# Altium project 3763.PrjPCB
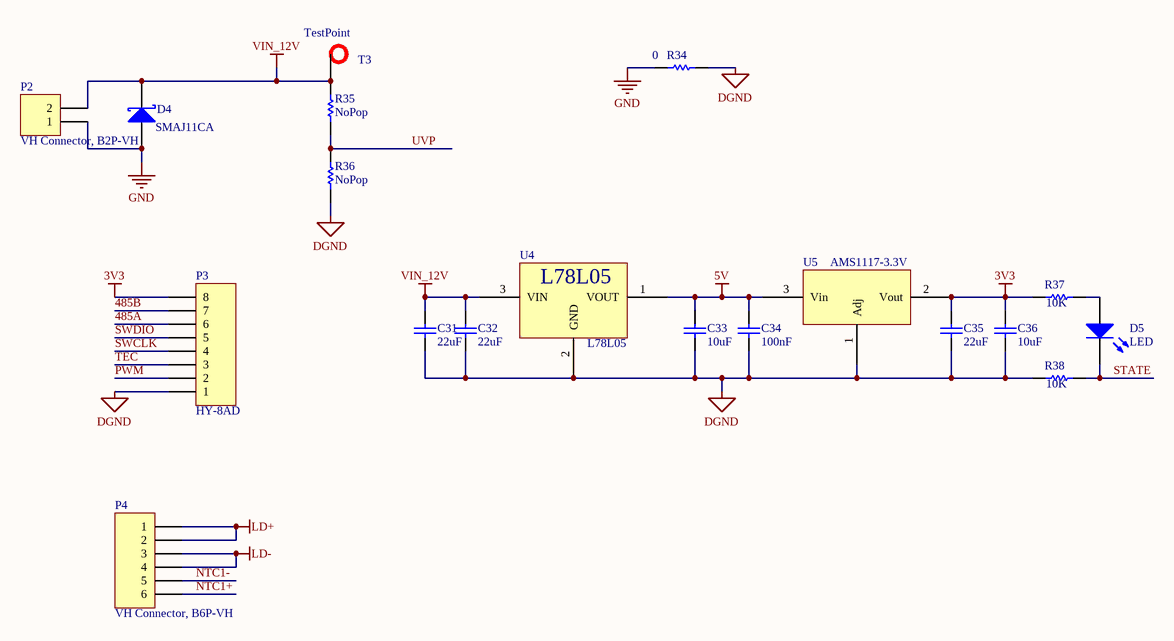
[diagram p0: PWR.SchDoc]
3 sheets, 66 parts. Net scope: global (net labels, ports and power ports of the same name join across sheets).
Board file: Green.PcbDoc
Sheets:
  PWR.SchDoc
  MCU.SchDoc
  3763.SchDoc

## Sheet PWR.SchDoc
size A4

### Parts
C31  22uF  [1608[0603]]
C32  22uF  [1608[0603]]
C33  10uF  [1608[0603]]
C34  100nF  [1608[0603]]
C35  22uF  [1608[0603]]
C36  10uF  [1608[0603]]
D4  SMAJ11CA  [SMA_DIOM5226X26N]
D5  LED  [2012[0805] - LED]
P2  VH Connector, B2P-VH  [2PIN-B2P_VH]
P3  HY-8AD  [8P -HY-8AD]
P4  VH Connector, B6P-VH  [6PIN-B6P_VH]
R34  0  [2012[0805]]
R35  NoPop  [1608[0603]]
R36  NoPop  [1608[0603]]
R37  10K  [1608[0603]]
R38  10K  [1608[0603]]
T3  Test Point  [TestPoint]  (value not drawn)
U4  L78L05  [SOT89-150P410X160-3N]
U5  AMS1117-3.3V  [SOT89-150P410X160-3N]

### Nets
3V3: C35.2 C36.2 P3.8 R37.2 U5.2(Vout)
5V: C33.2 C34.2 U4.1(VOUT) U5.3(Vin)
DGND: C31.1 C32.1 C33.1 C34.1 C35.1 C36.1 P3.1 P4.5 R34.1 R36.1 R38.2 U4.2(GND) U5.1(Adj)  [also labelled NTC1-]  [project net LP-]
GND: D4.1(A) P2.1 R34.2
LD+: P4.1 P4.2  [project net SENSE_N]
LD-: P4.3 P4.4
VIN_12V: C31.2 C32.2 D4.2(K) P2.2 R35.2 T3.1(TP) U4.3(VIN)  [project net IN_N]
485A: P3.6
485B: P3.7
NTC1+: P4.6
PWM: P3.2
STATE: D5.2(K) R38.1
SWCLK: P3.4
SWDIO: P3.5
TEC: P3.3
UVP: R35.1 R36.2
NetD5_1: D5.1(A) R37.1

### Notes on the sheet
- (in symbol TP) TestPoint

### Library data of the parts
C31-C36 = Cap: Capacitor; Published: 8-Jun-2000; LatestRevisionDate: 17-Jul-2002; LatestRevisionNote: Re-released for DXP Platform.; PackageReference: RAD-0.3; Publisher: Altium Limited; PackageDescription: Radial Cap, Thru-Hole; 2 Leads; 0.3 in Pin Spacing
  C31 C32 C35: Value: 22uF
  C33 C36: Value: 10uF
  C34: Value: 100nF
D4 = D Schottky: Schottky Diode; Published: 8-Jun-2000; LatestRevisionDate: 17-Jul-2002; LatestRevisionNote: Re-released for DXP Platform.; PackageReference: SMB; Publisher: Altium Limited; PackageDescription: DO-214-AA/SMB; 2 C-Bend Leads; Body 5.3 x 3.6 mm, inc. leads (LxW); Code_JEDEC: DO-214-AA
D5 = LED0: Typical INFRARED GaAs LED; Published: 8-Jun-2000; LatestRevisionDate: 08-Jul-2005; LatestRevisionNote: Mech Layer 1 removed.; PackageReference: LED-0; Publisher: Altium Limited; PackageDescription: LED; 2 Leads
P2 = Header 2: Header, 2-Pin; LatestRevisionDate: 17-Jul-2002; LatestRevisionNote: Re-released for DXP Platform.; Publisher: Altium Limited
P3 = Header 8: Header, 8-Pin; LatestRevisionDate: 17-Jul-2002; LatestRevisionNote: Re-released for DXP Platform.; Publisher: Altium Limited
P4 = Header 6: Header, 6-Pin; LatestRevisionDate: 17-Jul-2002; LatestRevisionNote: Re-released for DXP Platform.; Publisher: Altium Limited
R34 R37 R38 = Res1: Resistor; Published: 8-Jun-2000; LatestRevisionDate: 17-Jul-2002; LatestRevisionNote: Re-released for DXP Platform.; PackageReference: AXIAL-0.3; Publisher: Altium Limited; PackageDescription: Axial Device, Thru-Hole; 2 Leads; 0.3 in Pin Spacing
  R34: Value: 0
  R37 R38: Value: 10K
R35 = Res1: Resistor; Value: 20k; Published: 8-Jun-2000; LatestRevisionDate: 17-Jul-2002; LatestRevisionNote: Re-released for DXP Platform.; PackageReference: AXIAL-0.3; Publisher: Altium Limited; PackageDescription: Axial Device, Thru-Hole; 2 Leads; 0.3 in Pin Spacing
R36 = Res1: Resistor; Value: 2k; Published: 8-Jun-2000; LatestRevisionDate: 17-Jul-2002; LatestRevisionNote: Re-released for DXP Platform.; PackageReference: AXIAL-0.3; Publisher: Altium Limited; PackageDescription: Axial Device, Thru-Hole; 2 Leads; 0.3 in Pin Spacing
T3 = TP
U4 = PWR_L78L05: POSITIVE VOLTAGE REGULATORS
U5 = PWR_LM1XXX: 5V转3V3 10mA  DC/DC

## Sheet MCU.SchDoc
size A4
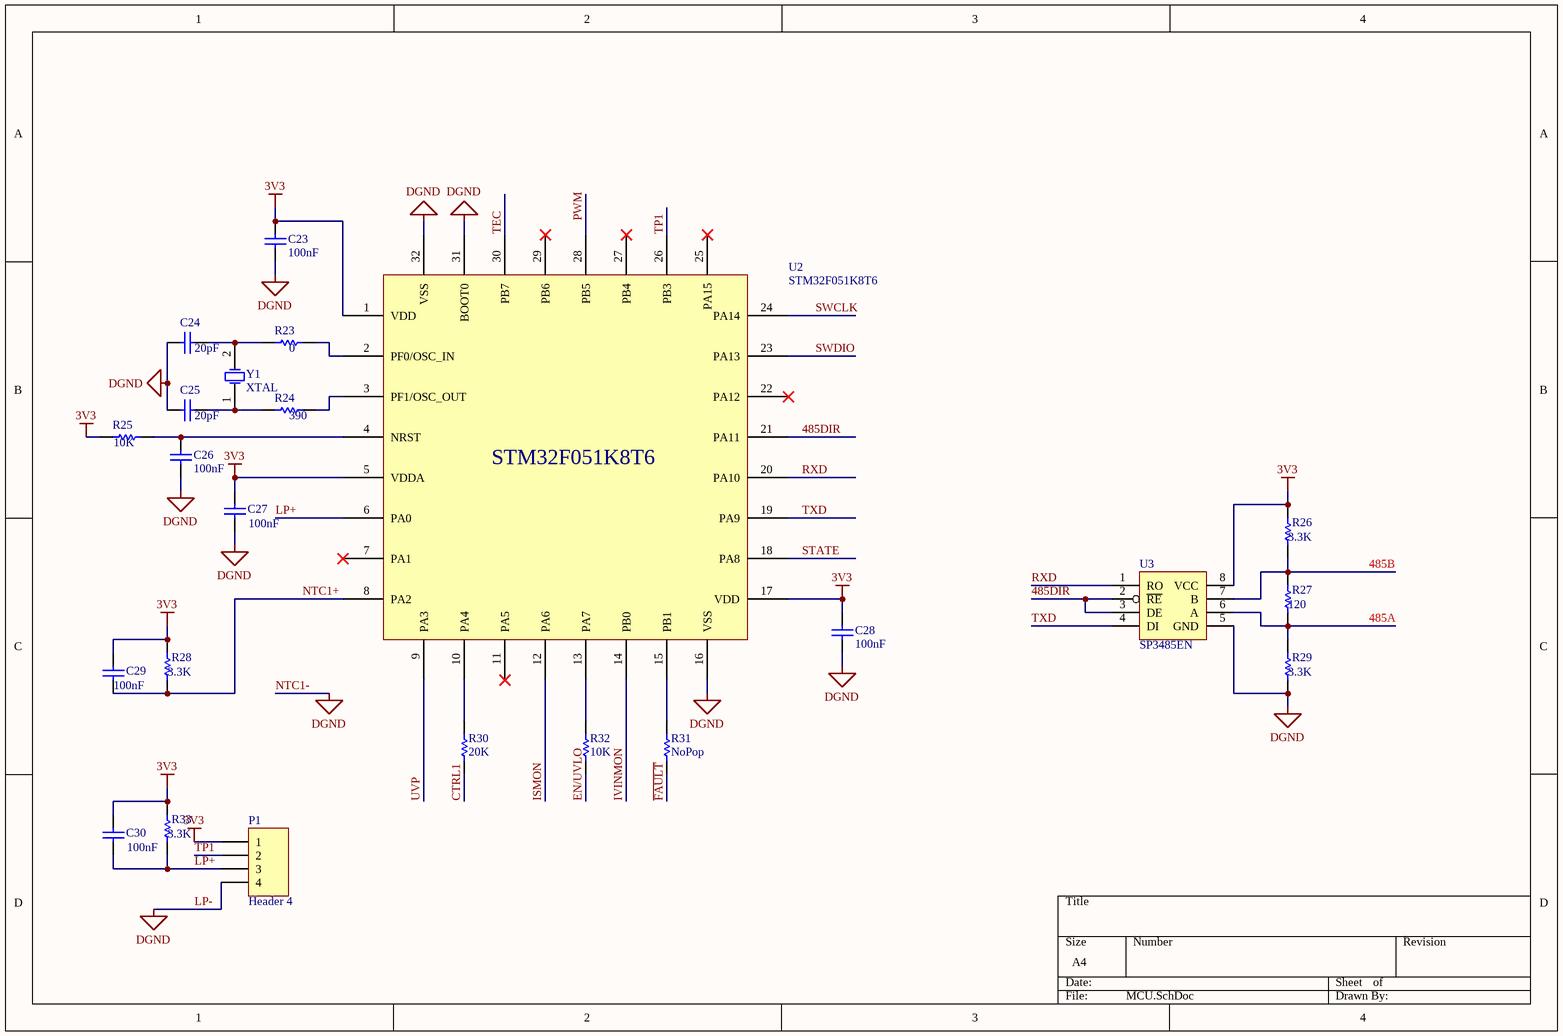
[diagram p1: MCU.SchDoc]

### Parts
C23  100nF  [1608[0603]]
C24  20pF  [1608[0603]]
C25  20pF  [1608[0603]]
C26  100nF  [1608[0603]]
C27  100nF  [1608[0603]]
C28  100nF  [1608[0603]]
C29  100nF  [1608[0603]]
C30  100nF  [1608[0603]]
P1  Header 4  [HDR1X4]
R23  0  [1608[0603]]
R24  390  [1608[0603]]
R25  10K  [1608[0603]]
R26  3.3K  [1608[0603]]
R27  120  [1608[0603]]
R28  3.3K  [1608[0603]]
R29  3.3K  [1608[0603]]
R30  20K  [1608[0603]]
R31  NoPop  [1608[0603]]
R32  10K  [1608[0603]]
R33  3.3K  [1608[0603]]
U2  STM32F051K8T6  [TQFP80P900X900X160-32N]
U3  SP3485EN  [SOIC127P600-8N]
Y1  XTAL  [XTAL_SMT]

### Nets
3V3: C23.2 C27.1 C28.2 C29.1 C30.1 P1.1 R25.2 R26.2 R28.1 R33.1 U2.1(VDD) U2.5(VDDA) U2.17(VDD) U3.8(VCC)
LP-: C23.1 C24.2 C25.2 C26.1 C27.2 C28.1 P1.4 R29.1 U2.16(VSS) U2.31(BOOT0) U2.32(VSS) U3.5(GND)  [also labelled DGND, NTC1-]
485A: R27.1 R29.2 U3.6(A)
485B: R26.1 R27.2 U3.7(B)
485DIR: U2.21(PA11) U3.2(~{RE}) U3.3(DE)
CTRL1: R30.1
EN/UVLO: R32.1
~{FAULT}: R31.1
ISMON: U2.12(PA6)
IVINMON: U2.14(PB0)
LP+: C30.2 P1.3 R33.2 U2.6(PA0)
NTC1+: C29.2 R28.2 U2.8(PA2)
PWM: U2.28(PB5)
RXD: U2.20(PA10) U3.1(RO)
STATE: U2.18(PA8)
SWCLK: U2.24(PA14)
SWDIO: U2.23(PA13)
TEC: U2.30(PB7)
TP1: P1.2 U2.26(PB3)
TXD: U2.19(PA9) U3.4(DI)
UVP: U2.9(PA3)
NetC24_1: C24.1 R23.1 Y1.2(OSC2)
NetC25_1: C25.1 R24.1 Y1.1(OSC1)
NetC26_2: C26.2 R25.1 U2.4(NRST)
NetR23_2: R23.2 U2.2(PF0/OSC_IN)
NetR24_2: R24.2 U2.3(PF1/OSC_OUT)
NetR30_2: R30.2 U2.10(PA4)
NetR31_2: R31.2 U2.15(PB1)
NetR32_2: R32.2 U2.13(PA7)

Not connected (* = marked no-connect by the designer): U2 7(PA1)* 11(PA5)* 22(PA12)* 25(PA15)* 27(PB4)* 29(PB6)*

### Library data of the parts
C23-C30 = Cap: Capacitor; Published: 8-Jun-2000; LatestRevisionDate: 17-Jul-2002; LatestRevisionNote: Re-released for DXP Platform.; PackageReference: RAD-0.3; Publisher: Altium Limited; PackageDescription: Radial Cap, Thru-Hole; 2 Leads; 0.3 in Pin Spacing
  C23 C26-C30: Value: 100nF
  C24 C25: Value: 20pF
P1 = Header 4: Header, 4-Pin; LatestRevisionDate: 17-Jul-2002; LatestRevisionNote: Re-released for DXP Platform.; Publisher: Altium Limited
R23-R30 R32 R33 = Res1: Resistor; Published: 8-Jun-2000; LatestRevisionDate: 17-Jul-2002; LatestRevisionNote: Re-released for DXP Platform.; PackageReference: AXIAL-0.3; Publisher: Altium Limited; PackageDescription: Axial Device, Thru-Hole; 2 Leads; 0.3 in Pin Spacing
  R23: Value: 0
  R24: Value: 390
  R25 R32: Value: 10K
  R26 R28 R29 R33: Value: 3.3K
  R27: Value: 120
  R30: Value: 20k
R31 = Res1: Resistor; Value: 0; Published: 8-Jun-2000; LatestRevisionDate: 17-Jul-2002; LatestRevisionNote: Re-released for DXP Platform.; PackageReference: AXIAL-0.3; Publisher: Altium Limited; PackageDescription: Axial Device, Thru-Hole; 2 Leads; 0.3 in Pin Spacing
U2 = MCU_STM32F051K8T6: Low- and medium-density advanced ARM?-based 32-bit MCU with  16 to 64 Kbytes Flash, timers, ADC, DAC and comm. interfaces
U3 = LGC_RS485: Low-Power, Slew-Rate-Limited  RS-485/RS-422 Transceivers
Y1 = XTAL: Crystal Oscillator; Published: 8-Jun-2000; LatestRevisionDate: 17-Jul-2002; LatestRevisionNote: Re-released for DXP Platform.; PackageReference: R38; Publisher: Altium Limited; PackageDescription: Crystal, Thru-Hole; 2 Leads; Body 3.1 x 8.2 mm (Dia.xH)

## Sheet 3763.SchDoc
size A4
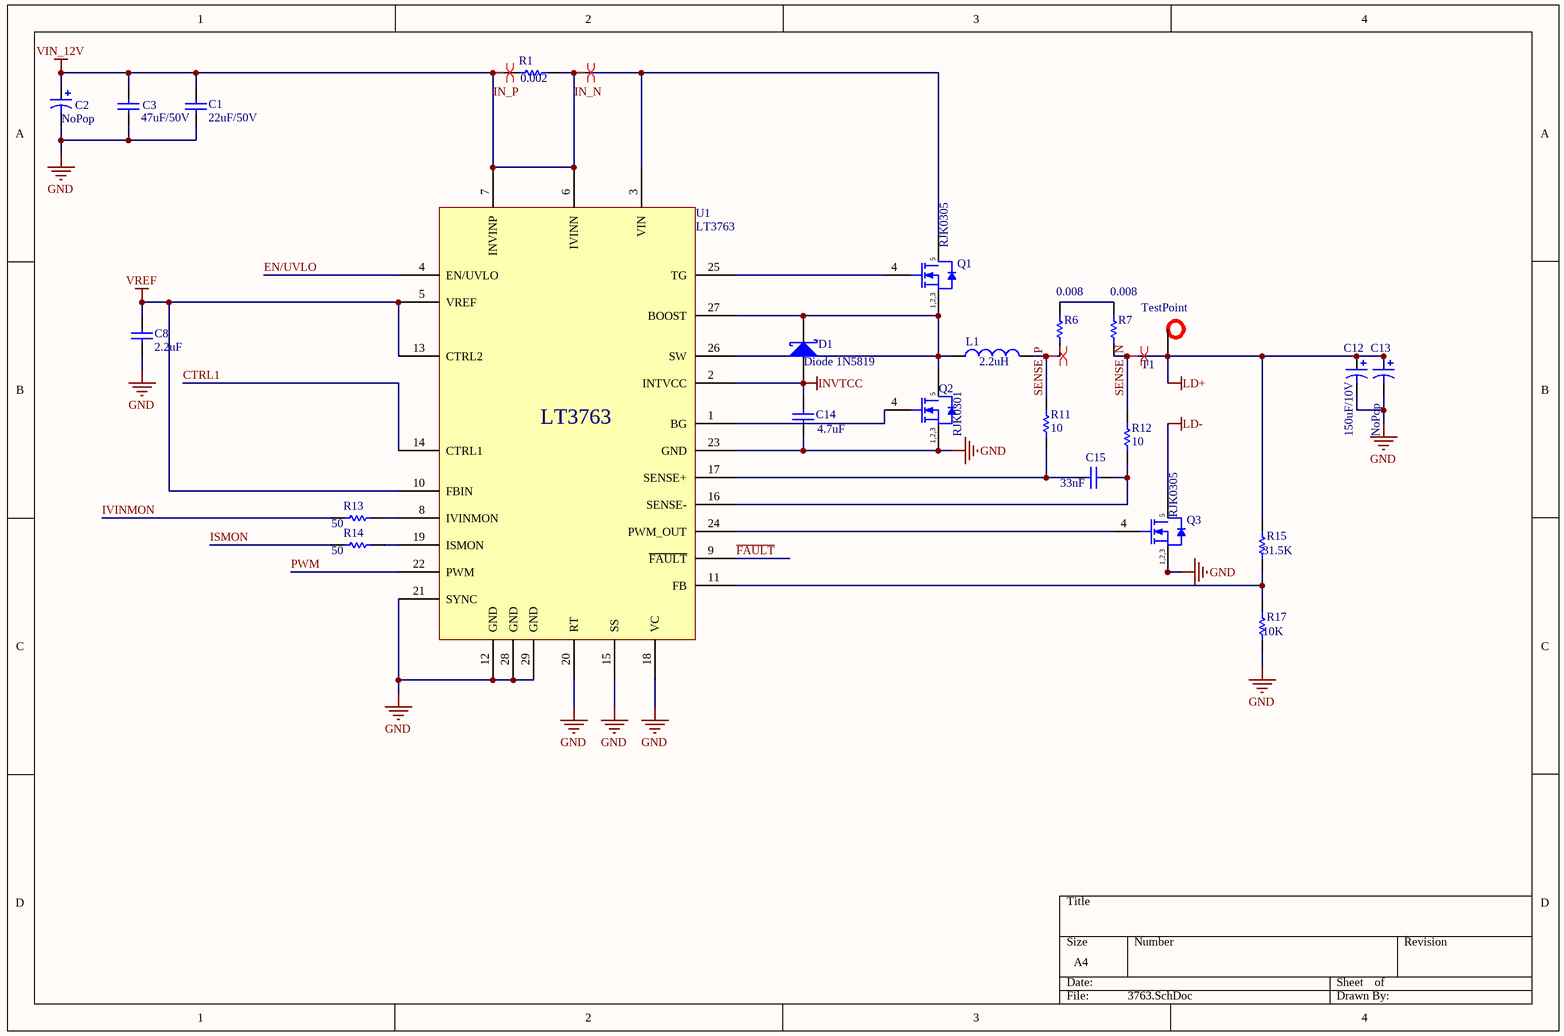
[diagram p2: 3763.SchDoc]

### Parts
C1  22uF/50V  [1206[3216] - NP]
C2  NoPop  [SMC_Altium Capacity 8*10]
C3  47uF/50V  [1206[3216] - NP]
C8  2.2uF  [1608[0603]]
C12  150uF/10V  [7343]
C13  NoPop  [SMC_Altium Capacity 8*10]
C14  4.7uF  [1608[0603]]
C15  33nF  [1608[0603]]
D1  Diode 1N5819  [SMA]
L1  value 2.2uH  [IHLP4040]  (hidden comment: Inductor,2.2uH)
Q1  RJK0305  [LFPAK]
Q2  RJK0301  [LFPAK]
Q3  RJK0305  [LFPAK]
R1  0.002  [2512[6432]]
R6  0.008  [2512[6432]]
R7  0.008  [2512[6432]]
R11  10  [1608[0603]]
R12  10  [1608[0603]]
R13  50  [1608[0603]]
R14  50  [1608[0603]]
R15  31.5K  [1608[0603]]
R17  10K  [1608[0603]]
T1  Test Point  [TestPoint]  (value not drawn)
U1  LT3763  [TSOP65P640X120_HS-29N]

### Nets
GND: C1.1 C2.2 C3.1 C8.1 C12.2 C13.2 C14.1 Q2.1(SOURCE) Q2.2(SOURCE) Q2.3(SOURCE) Q3.1(SOURCE) Q3.2(SOURCE) Q3.3(SOURCE) R17.2 U1.12(GND) U1.15(SS) U1.18(VC) U1.20(RT) U1.21(SYNC) U1.23(GND) U1.28(GND) U1.29(GND)
IN_N: C1.2 C2.1 C3.2 Q1.5(DRAIN) R1.1 R1.2 U1.3(VIN) U1.6(IVINN) U1.7(INVINP)  [also labelled IN_P, VIN_12V]
INVTCC: C14.2 D1.1(A) U1.2(INTVCC)
LD-: Q3.5(DRAIN)
SENSE_N: C12.1 C13.1 R7.1 R12.2 R15.1 T1.1(TP)  [also labelled LD+]
VREF: C8.2 U1.5(VREF) U1.10(FBIN) U1.13(CTRL2)
CTRL1: U1.14(CTRL1)
EN/UVLO: U1.4(EN/UVLO)
~{FAULT}: U1.9(~{FAULT})
ISMON: R14.2
IVINMON: R13.2
PWM: U1.22(PWM)
SENSE_P: L1.2 R6.1 R11.2
NetC15_1: C15.1 R11.1 U1.17(SENSE+)
NetC15_2: C15.2 R12.1 U1.16(SENSE-)
NetD1_2: D1.2(K) L1.1 Q1.1(SOURCE) Q1.2(SOURCE) Q1.3(SOURCE) Q2.5(DRAIN) U1.26(SW) U1.27(BOOST)
NetQ1_4: Q1.4(GATE) U1.25(TG)
NetQ2_4: Q2.4(GATE) U1.1(BG)
NetQ3_4: Q3.4(GATE) U1.24(PWM_OUT)
NetR6_2: R6.2 R7.2
NetR13_1: R13.1 U1.8(IVINMON)
NetR14_1: R14.1 U1.19(ISMON)
NetR15_2: R15.2 R17.1 U1.11(FB)

### Layout directives
differential pair: IN_N, SENSE_N, SENSE_P

### Notes on the sheet
- (in symbol PWR_RJK030) 1,2,3
- (in symbol TP) TestPoint

### Library data of the parts
C1 = Cap: Capacitor; Value: 22uF; Published: 8-Jun-2000; LatestRevisionDate: 17-Jul-2002; LatestRevisionNote: Re-released for DXP Platform.; PackageReference: RAD-0.3; Publisher: Altium Limited; PackageDescription: Radial Cap, Thru-Hole; 2 Leads; 0.3 in Pin Spacing
C2 C13 = Cap Pol1: Altium Electrolytic Cap; Value: 100uF/50V; Published: 8-Jun-2000; LatestRevisionDate: 17-Jul-2002; LatestRevisionNote: Re-released for DXP Platform.; PackageReference: RB7.6-15; Publisher: Altium Limited; PackageDescription: Polarized Capacitor (Radial); 2 Leads
C3 = Cap: Capacitor; Value: 47uF; Published: 8-Jun-2000; LatestRevisionDate: 17-Jul-2002; LatestRevisionNote: Re-released for DXP Platform.; PackageReference: RAD-0.3; Publisher: Altium Limited; PackageDescription: Radial Cap, Thru-Hole; 2 Leads; 0.3 in Pin Spacing
C8 C14 C15 = Cap: Capacitor; Published: 8-Jun-2000; LatestRevisionDate: 17-Jul-2002; LatestRevisionNote: Re-released for DXP Platform.; PackageReference: RAD-0.3; Publisher: Altium Limited; PackageDescription: Radial Cap, Thru-Hole; 2 Leads; 0.3 in Pin Spacing
  C8: Value: 2.2uF
  C14: Value: 4.7uF
  C15: Value: 33nF
C12 = Cap Pol1: Tantum Cap; Value: 150uF; Published: 8-Jun-2000; LatestRevisionDate: 17-Jul-2002; LatestRevisionNote: Re-released for DXP Platform.; PackageReference: RB7.6-15; Publisher: Altium Limited; PackageDescription: Polarized Capacitor (Radial); 2 Leads
D1 = D Schottky: Schottky Diode; Published: 8-Jun-2000; LatestRevisionDate: 17-Jul-2002; LatestRevisionNote: Re-released for DXP Platform.; PackageReference: SMB; Publisher: Altium Limited; PackageDescription: DO-214-AA/SMB; 2 C-Bend Leads; Body 5.3 x 3.6 mm, inc. leads (LxW); Code_JEDEC: DO-214-AA
L1 = Inductor: Code_IEC: 1005; Published: 8-Jun-2000; LatestRevisionDate: 29-May-2009; LatestRevisionNote: IPC-7351 Footprint Added.; PackageReference: 0402-A; Publisher: Altium Limited; PackageDescription: Chip Inductor; Code_JEITA: 0402
Q1-Q3 = PWR_RJK030: N_MOSFET; Manufacturer: Infineon; PartNumber: BSC160N10NS3 G; Green: TRUE; ID (max): 42 A; IDpuls (max): 168 A; Packing: Reel; Polarity: N; Ptot (max): 60 W; QG: 19 nC; RDS (on) (max): 16 mOhm; Rth: 2.1 K/W; RthJA (max): 50 K/W; VDS (max): 100 V; VGS(th) (max): 3.5 V; VGS(th) (min): 2 V; DatasheetVersion: Rev. 2.4; PackageReference: PG-TDSON-8-1; PackageDescription: 8-Pin Plastic (Green) Thin Dual Small Outline Non-Leaded Package, 5.15 x 5.9 mm Body, 1.27 mm Pitch; Supplier 1: Digi-Key; Supplier Part Number 1: BSC160N10NS3 GINTR-ND; Supplier 2: Digi-Key; Supplier Part Number 2: BSC160N10NS3 GINCT-ND; Supplier 3: Digi-Key; Supplier Part Number 3: BSC160N10NS3 GINDKR-ND; Supplier 4: Mouser; Supplier Part Number 4: 726-BSC160N10NS3G; Halogen-free: TRUE; RthJC (max): 2.1 K/W; Mounting Technology: Surface Mount; ComponentLink1Description: Manufacturer URL; ComponentLink1URL: http://www.infineon.com/; ComponentLink2Description: Datasheet; ComponentLink2URL: http://www.infineon.com/dgdl/BSC160N10NS3+Rev2.4.pdf?folderId=db3a304313b8b5a60113cee8763b02d7&fileId=db3a30432239cccd01226040189a7f47; ComponentLink3Description: Package Specification; ComponentLink3URL: http://www.infineon.com/cms/packages/SMD_-_Surface_Mounted_Devices/P-PG-TDSON/P-PG-TDSON-08-01x_2x_3.html?__locale=en
R1 = Res1: Resistor; Value: 2m; Published: 8-Jun-2000; LatestRevisionDate: 17-Jul-2002; LatestRevisionNote: Re-released for DXP Platform.; PackageReference: AXIAL-0.3; Publisher: Altium Limited; PackageDescription: Axial Device, Thru-Hole; 2 Leads; 0.3 in Pin Spacing
R6 R7 = Res1: Resistor; Value: 8m; Published: 8-Jun-2000; LatestRevisionDate: 17-Jul-2002; LatestRevisionNote: Re-released for DXP Platform.; PackageReference: AXIAL-0.3; Publisher: Altium Limited; PackageDescription: Axial Device, Thru-Hole; 2 Leads; 0.3 in Pin Spacing
R11-R15 R17 = Res1: Resistor; Published: 8-Jun-2000; LatestRevisionDate: 17-Jul-2002; LatestRevisionNote: Re-released for DXP Platform.; PackageReference: AXIAL-0.3; Publisher: Altium Limited; PackageDescription: Axial Device, Thru-Hole; 2 Leads; 0.3 in Pin Spacing
  R11 R12: Value: 10
  R13 R14: Value: 50
  R15: Value: 31.5K
  R17: Value: 10K
T1 = TP
U1 = PWR_LT3763: 60V High Current   Step-Down LED Driver Controller

## Nets that join several sheets
3V3: PWR (5 pins), MCU (14 pins)
GND: PWR (D4.1 P2.1 R34.2), 3763 (22 pins)
IN_N: PWR (7 pins), 3763 (9 pins)
LD-: PWR (P4.3 P4.4), 3763 (Q3.5)
LP-: PWR (13 pins), MCU (12 pins)
SENSE_N: PWR (P4.1 P4.2), 3763 (6 pins)
485A: PWR (P3.6), MCU (R27.1 R29.2 U3.6)
485B: PWR (P3.7), MCU (R26.1 R27.2 U3.7)
CTRL1: MCU (R30.1), 3763 (U1.14)
EN/UVLO: MCU (R32.1), 3763 (U1.4)
~{FAULT}: MCU (R31.1), 3763 (U1.9)
ISMON: MCU (U2.12), 3763 (R14.2)
IVINMON: MCU (U2.14), 3763 (R13.2)
NTC1+: PWR (P4.6), MCU (C29.2 R28.2 U2.8)
PWM: PWR (P3.2), MCU (U2.28), 3763 (U1.22)
STATE: PWR (D5.2 R38.1), MCU (U2.18)
SWCLK: PWR (P3.4), MCU (U2.24)
SWDIO: PWR (P3.5), MCU (U2.23)
TEC: PWR (P3.3), MCU (U2.30)
UVP: PWR (R35.1 R36.2), MCU (U2.9)